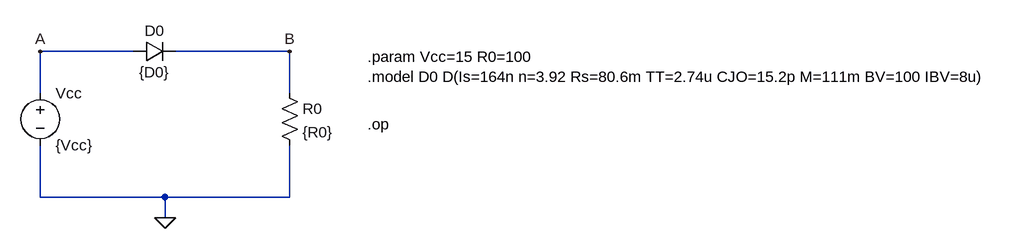
[diagram p0: schematic Lab EaD 01 A.asc]
Lab EaD 01 A.asc, the LTspice schematic file:
Version 4
SHEET 1 1484 680
WIRE 80 48 -64 48
WIRE 320 48 144 48
WIRE -64 112 -64 48
WIRE 320 112 320 48
WIRE -64 272 -64 192
WIRE 128 272 -64 272
WIRE 320 272 320 192
WIRE 320 272 128 272
WIRE 128 304 128 272
FLAG 128 304 0
FLAG -64 48 A
FLAG 320 48 B
SYMBOL voltage -64 96 R0
WINDOW 123 0 0 Left 0
WINDOW 39 0 0 Left 0
SYMATTR InstName Vcc
SYMATTR Value {Vcc}
SYMBOL diode 80 64 R270
WINDOW 0 32 32 VTop 2
WINDOW 3 0 32 VBottom 2
SYMATTR InstName D0
SYMATTR Value {D0}
SYMBOL res 304 96 R0
SYMATTR InstName R0
SYMATTR Value {R0}
TEXT 440 160 Left 2 !.op
TEXT 440 56 Left 2 !.param Vcc=15 R0=100\n.model D0 D(Is=164n n=3.92 Rs=80.6m TT=2.74u CJO=15.2p M=111m BV=100 IBV=8u)

The netlist it stands for:
* Lab EaD 01 A.asc
Vcc A 0 {Vcc}
D0 A B {D0}
R0 B 0 {R0}
.model D D
.lib standard.dio
.op
.param Vcc=15 R0=100
.model D0 D(Is=164n n=3.92 Rs=80.6m TT=2.74u CJO=15.2p M=111m BV=100 IBV=8u)
.backanno
.end

* Results of the author's LTspice run, read from the files saved beside the schematic
* Operating Point:
*   V(a) = 15 V
*   V(b) = 13.61 V
*   I(D0) = 136.1 mA
*   I(R0) = 136.1 mA
*   I(Vcc) = -136.1 mA
* From the log:
*   Semiconductor Device Operating Points:
*                           --- Diodes ---
*   Name:      d0
*   Model:     d0
*   Id:      1.36e-01
*   Vd:      1.39e+00
*   Req:     7.45e-01
*   CAP:     3.68e-06